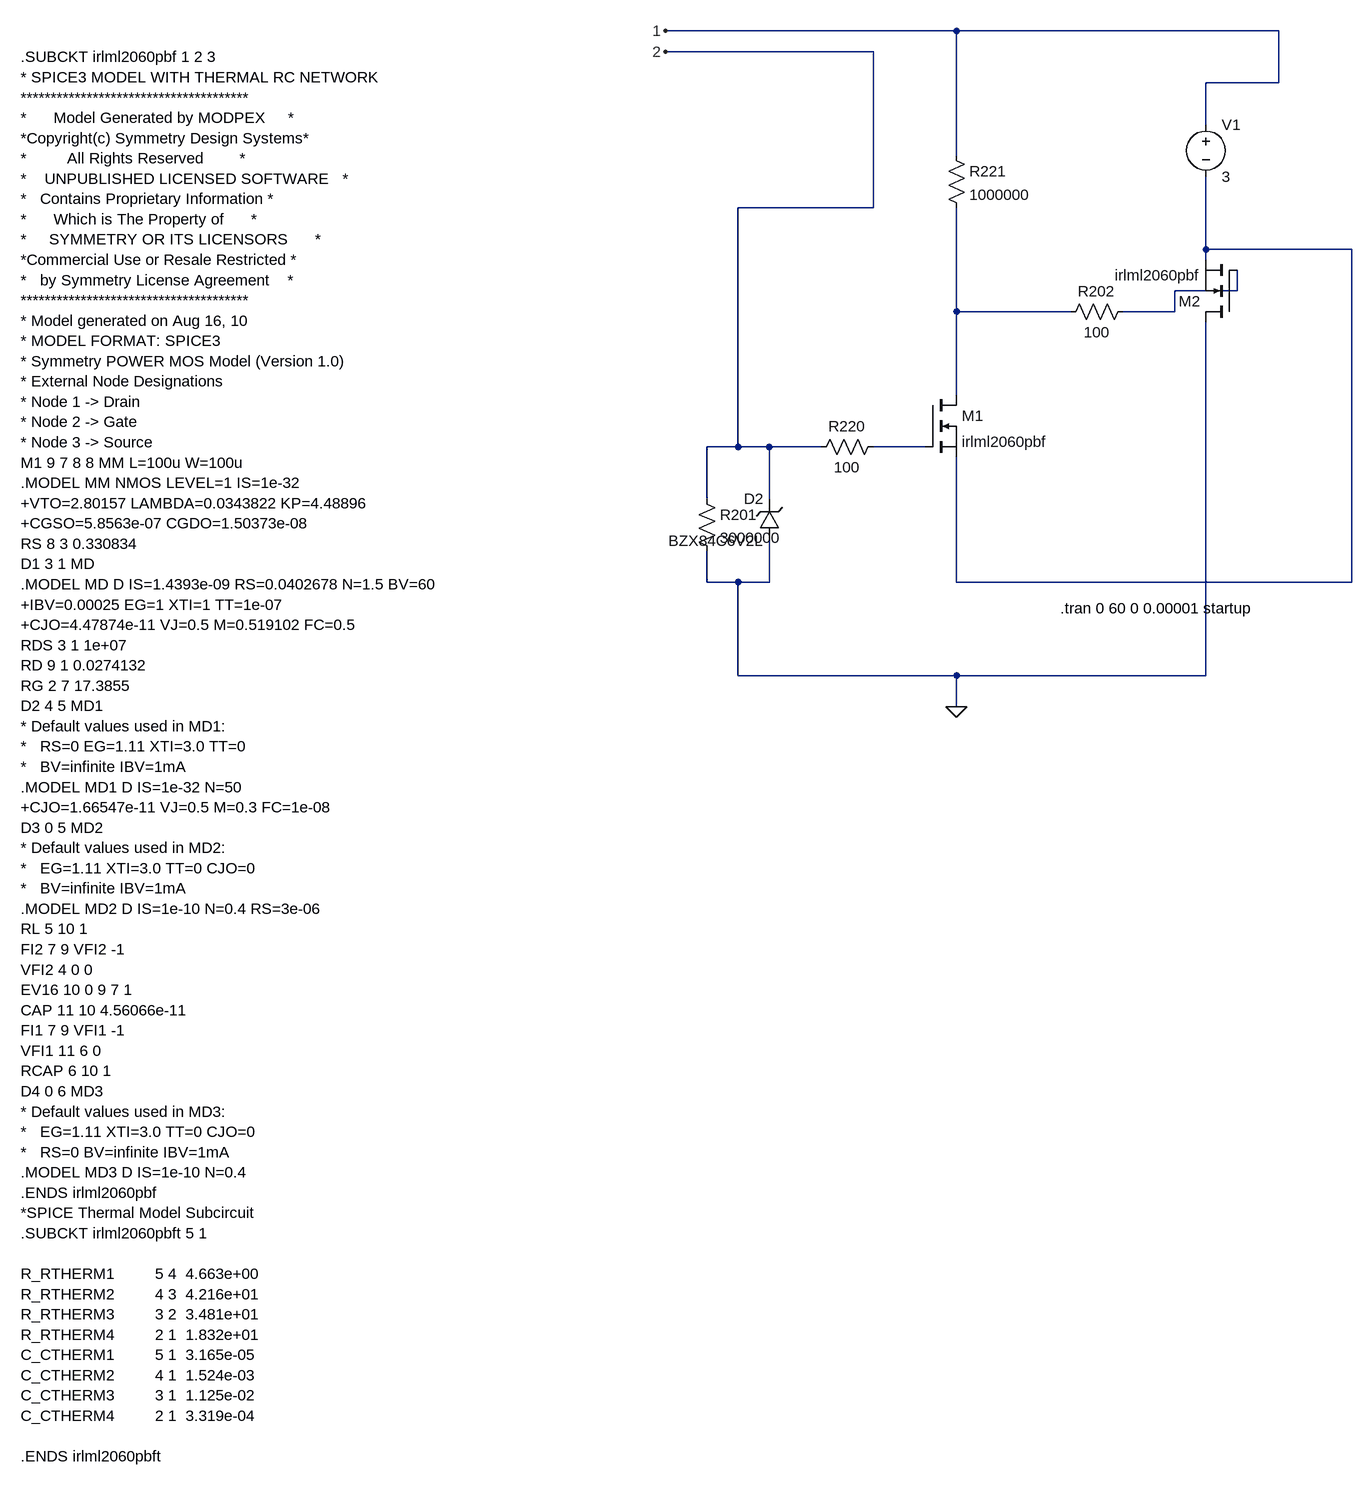
[diagram p0: schematic RBF_inhibit.asc]
RBF_inhibit.asc, the LTspice schematic file:
Version 4
SHEET 1 1764 1580
WIRE 320 -464 -128 -464
WIRE 816 -464 320 -464
WIRE 192 -432 -128 -432
WIRE 816 -384 816 -464
WIRE 816 -384 704 -384
WIRE 704 -320 704 -384
WIRE 320 -272 320 -464
WIRE 192 -192 192 -432
WIRE 192 -192 -16 -192
WIRE 704 -128 704 -240
WIRE 928 -128 704 -128
WIRE 704 -112 704 -128
WIRE 752 -64 752 -96
WIRE 752 -64 656 -64
WIRE 320 -32 320 -192
WIRE 496 -32 320 -32
WIRE 656 -32 656 -64
WIRE 656 -32 576 -32
WIRE 320 96 320 -32
WIRE -16 176 -16 -192
WIRE -16 176 -64 176
WIRE 32 176 -16 176
WIRE 112 176 32 176
WIRE 272 176 192 176
WIRE -64 256 -64 176
WIRE 32 256 32 176
WIRE -64 384 -64 336
WIRE -16 384 -64 384
WIRE 32 384 32 320
WIRE 32 384 -16 384
WIRE 320 384 320 192
WIRE 928 384 928 -128
WIRE 928 384 320 384
WIRE -16 528 -16 384
WIRE 320 528 -16 528
WIRE 704 528 704 -16
WIRE 704 528 320 528
WIRE 320 576 320 528
FLAG -128 -464 1
FLAG -128 -432 2
FLAG 320 576 0
SYMBOL res -80 240 R0
SYMATTR InstName R201
SYMATTR Value 3000000
SYMBOL res 208 160 R90
WINDOW 0 0 56 VBottom 2
WINDOW 3 32 56 VTop 2
SYMATTR InstName R220
SYMATTR Value 100
SYMBOL res 304 -288 R0
SYMATTR InstName R221
SYMATTR Value 1000000
SYMBOL voltage 704 -336 R0
WINDOW 123 0 0 Left 0
WINDOW 39 0 0 Left 0
SYMATTR InstName V1
SYMATTR Value 3
SYMBOL nmos 272 96 R0
SYMATTR InstName M1
SYMATTR Value irlml2060pbf
SYMATTR Prefix X
SYMBOL nmos 752 -16 R180
SYMATTR InstName M2
SYMATTR Value irlml2060pbf
SYMATTR Prefix X
SYMBOL zener 48 320 R180
WINDOW 0 24 64 Left 2
WINDOW 3 24 0 Left 2
SYMATTR InstName D2
SYMATTR Value BZX84C6V2L
SYMATTR Value2 0
SYMATTR SpiceLine 1
SYMATTR SpiceLine2 2
SYMBOL res 592 -48 R90
WINDOW 0 0 56 VBottom 2
WINDOW 3 32 56 VTop 2
SYMATTR InstName R202
SYMATTR Value 100
TEXT 480 424 Left 2 !.tran 0 60 0 0.00001 startup
TEXT -1120 -424 Left 2 !.SUBCKT irlml2060pbf 1 2 3\n* SPICE3 MODEL WITH THERMAL RC NETWORK\n**************************************\n*      Model Generated by MODPEX     *\n*Copyright(c) Symmetry Design Systems*\n*         All Rights Reserved        *\n*    UNPUBLISHED LICENSED SOFTWARE   *\n*   Contains Proprietary Information *\n*      Which is The Property of      *\n*     SYMMETRY OR ITS LICENSORS      *\n*Commercial Use or Resale Restricted *\n*   by Symmetry License Agreement    *\n**************************************\n* Model generated on Aug 16, 10\n* MODEL FORMAT: SPICE3\n* Symmetry POWER MOS Model (Version 1.0)\n* External Node Designations\n* Node 1 -> Drain\n* Node 2 -> Gate\n* Node 3 -> Source\nM1 9 7 8 8 MM L=100u W=100u\n.MODEL MM NMOS LEVEL=1 IS=1e-32\n+VTO=2.80157 LAMBDA=0.0343822 KP=4.48896\n+CGSO=5.8563e-07 CGDO=1.50373e-08\nRS 8 3 0.330834\nD1 3 1 MD\n.MODEL MD D IS=1.4393e-09 RS=0.0402678 N=1.5 BV=60\n+IBV=0.00025 EG=1 XTI=1 TT=1e-07\n+CJO=4.47874e-11 VJ=0.5 M=0.519102 FC=0.5\nRDS 3 1 1e+07\nRD 9 1 0.0274132\nRG 2 7 17.3855\nD2 4 5 MD1\n* Default values used in MD1:\n*   RS=0 EG=1.11 XTI=3.0 TT=0\n*   BV=infinite IBV=1mA\n.MODEL MD1 D IS=1e-32 N=50\n+CJO=1.66547e-11 VJ=0.5 M=0.3 FC=1e-08\nD3 0 5 MD2\n* Default values used in MD2:\n*   EG=1.11 XTI=3.0 TT=0 CJO=0\n*   BV=infinite IBV=1mA\n.MODEL MD2 D IS=1e-10 N=0.4 RS=3e-06\nRL 5 10 1\nFI2 7 9 VFI2 -1\nVFI2 4 0 0\nEV16 10 0 9 7 1\nCAP 11 10 4.56066e-11\nFI1 7 9 VFI1 -1\nVFI1 11 6 0\nRCAP 6 10 1\nD4 0 6 MD3\n* Default values used in MD3:\n*   EG=1.11 XTI=3.0 TT=0 CJO=0\n*   RS=0 BV=infinite IBV=1mA\n.MODEL MD3 D IS=1e-10 N=0.4\n.ENDS irlml2060pbf\n*SPICE Thermal Model Subcircuit\n.SUBCKT irlml2060pbft 5 1\n \nR_RTHERM1         5 4  4.663e+00\nR_RTHERM2         4 3  4.216e+01\nR_RTHERM3         3 2  3.481e+01\nR_RTHERM4         2 1  1.832e+01\nC_CTHERM1         5 1  3.165e-05\nC_CTHERM2         4 1  1.524e-03\nC_CTHERM3         3 1  1.125e-02\nC_CTHERM4         2 1  3.319e-04\n \n.ENDS irlml2060pbft

The netlist it stands for:
* RBF_inhibit.asc
R201 2 0 3000000
R220 N004 2 100
R221 1 N003 1000000
V1 1 N001 3
XM1 N003 N004 N001 irlml2060pbf  ; pins D G S
XM2 0 N002 N001 irlml2060pbf  ; pins D G S
D2 0 2 BZX84C6V2L 0 1 2
R202 N002 N003 100
.model D D
.lib standard.dio
.tran 0 60 0 0.00001 startup
.SUBCKT irlml2060pbf 1 2 3
* SPICE3 MODEL WITH THERMAL RC NETWORK
**************************************
*      Model Generated by MODPEX     *
*Copyright(c) Symmetry Design Systems*
*         All Rights Reserved        *
*    UNPUBLISHED LICENSED SOFTWARE   *
*   Contains Proprietary Information *
*      Which is The Property of      *
*     SYMMETRY OR ITS LICENSORS      *
*Commercial Use or Resale Restricted *
*   by Symmetry License Agreement    *
**************************************
* Model generated on Aug 16, 10
* MODEL FORMAT: SPICE3
* Symmetry POWER MOS Model (Version 1.0)
* External Node Designations
* Node 1 -> Drain
* Node 2 -> Gate
* Node 3 -> Source
M1 9 7 8 8 MM L=100u W=100u
.MODEL MM NMOS LEVEL=1 IS=1e-32
+VTO=2.80157 LAMBDA=0.0343822 KP=4.48896
+CGSO=5.8563e-07 CGDO=1.50373e-08
RS 8 3 0.330834
D1 3 1 MD
.MODEL MD D IS=1.4393e-09 RS=0.0402678 N=1.5 BV=60
+IBV=0.00025 EG=1 XTI=1 TT=1e-07
+CJO=4.47874e-11 VJ=0.5 M=0.519102 FC=0.5
RDS 3 1 1e+07
RD 9 1 0.0274132
RG 2 7 17.3855
D2 4 5 MD1
* Default values used in MD1:
*   RS=0 EG=1.11 XTI=3.0 TT=0
*   BV=infinite IBV=1mA
.MODEL MD1 D IS=1e-32 N=50
+CJO=1.66547e-11 VJ=0.5 M=0.3 FC=1e-08
D3 0 5 MD2
* Default values used in MD2:
*   EG=1.11 XTI=3.0 TT=0 CJO=0
*   BV=infinite IBV=1mA
.MODEL MD2 D IS=1e-10 N=0.4 RS=3e-06
RL 5 10 1
FI2 7 9 VFI2 -1
VFI2 4 0 0
EV16 10 0 9 7 1
CAP 11 10 4.56066e-11
FI1 7 9 VFI1 -1
VFI1 11 6 0
RCAP 6 10 1
D4 0 6 MD3
* Default values used in MD3:
*   EG=1.11 XTI=3.0 TT=0 CJO=0
*   RS=0 BV=infinite IBV=1mA
.MODEL MD3 D IS=1e-10 N=0.4
.ENDS irlml2060pbf
*SPICE Thermal Model Subcircuit
.SUBCKT irlml2060pbft 5 1
R_RTHERM1         5 4  4.663e+00
R_RTHERM2         4 3  4.216e+01
R_RTHERM3         3 2  3.481e+01
R_RTHERM4         2 1  1.832e+01
C_CTHERM1         5 1  3.165e-05
C_CTHERM2         4 1  1.524e-03
C_CTHERM3         3 1  1.125e-02
C_CTHERM4         2 1  3.319e-04
.ENDS irlml2060pbft
.backanno
.end